# EAGLE design PIC18F14K50 PTH USB Dev Board (EAGLE 5.11)
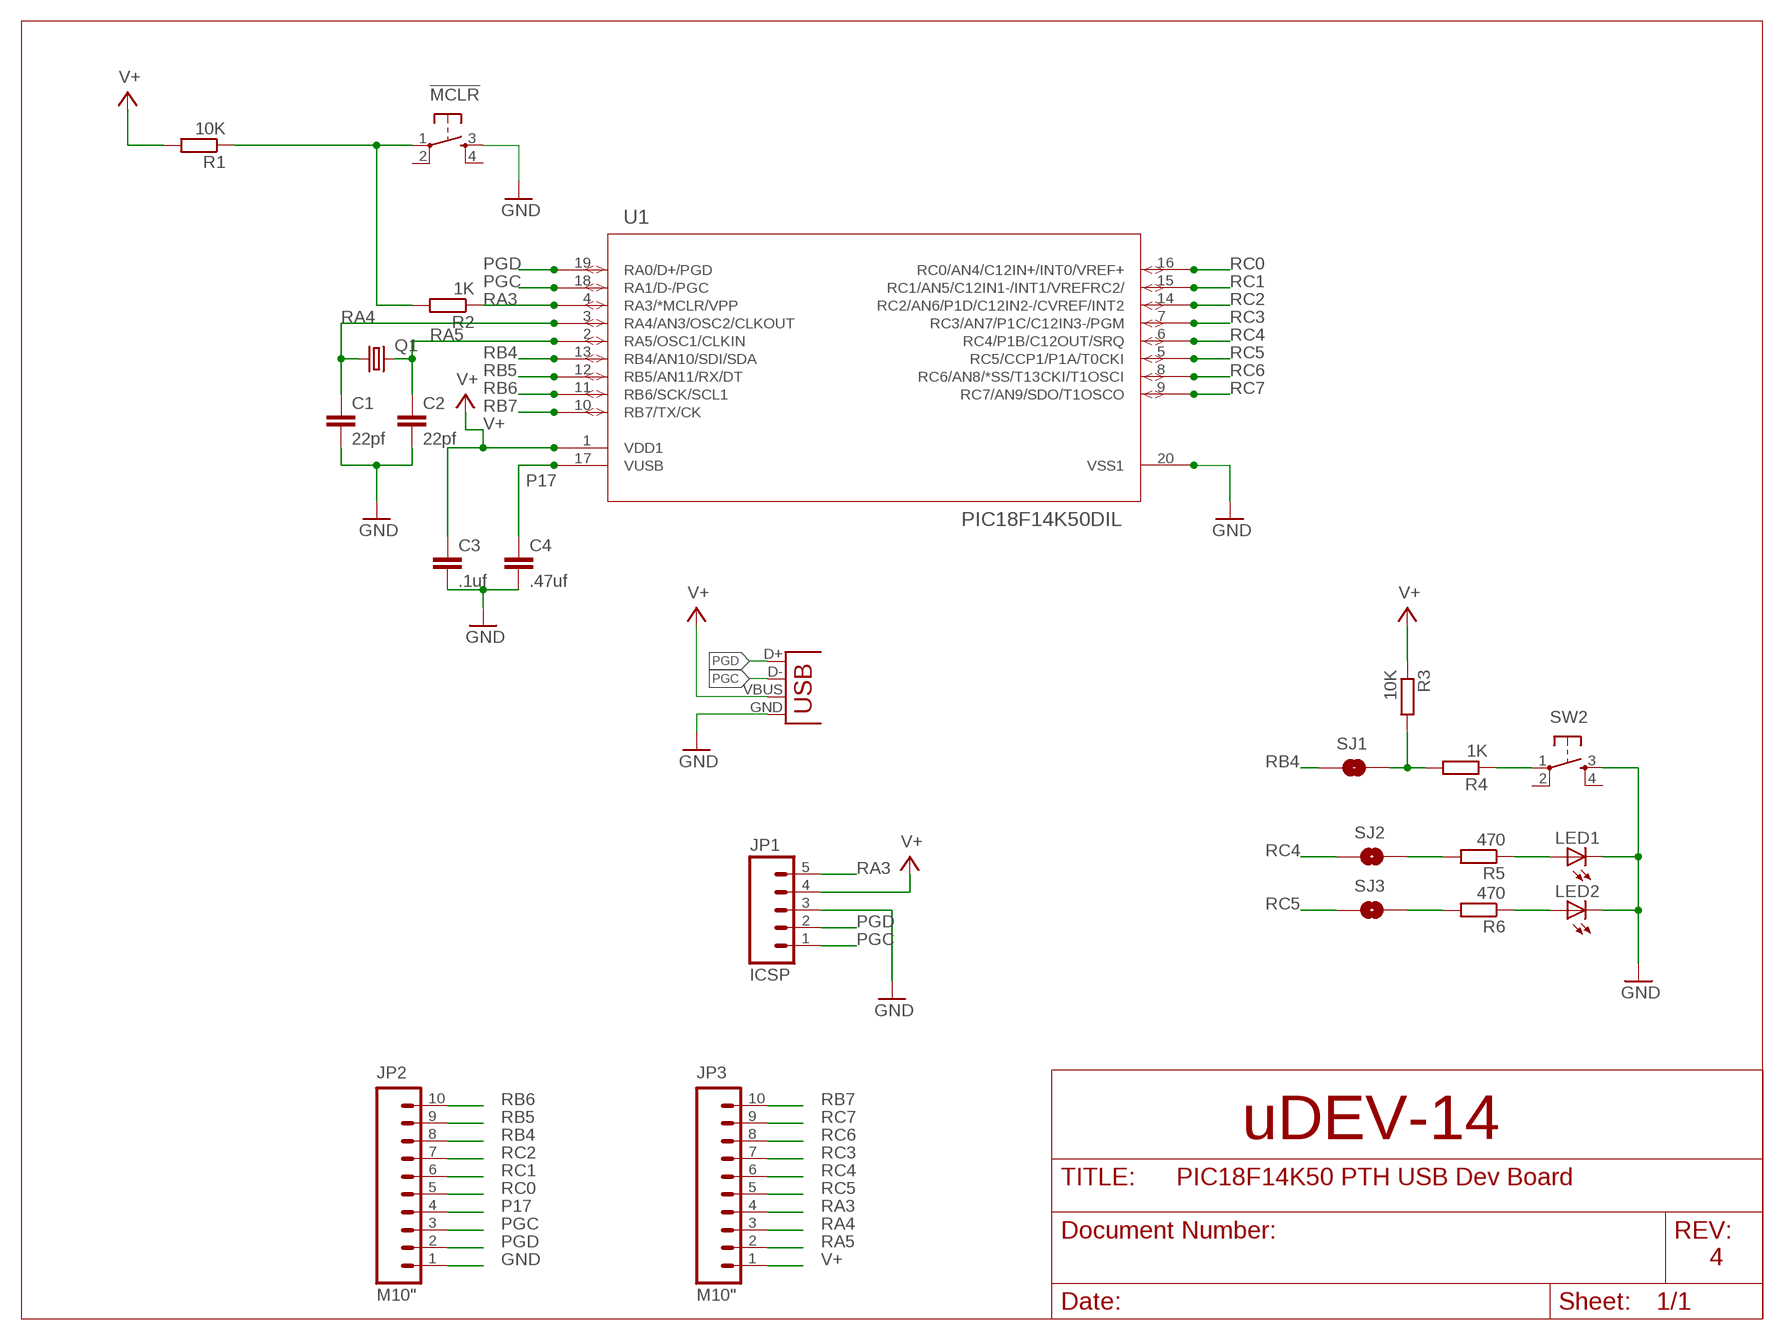
[diagram p0: schematic, sheet 1]

## Parts
!MCLR  TAC_SWITCHPTH  [TACTILE-PTH]
C1  22pf  C-EU025-025X050  [C025-025X050]
C2  22pf  C-EU025-025X050  [C025-025X050]
C3  .1uf  C-EU025-025X050  [C025-025X050]
C4  .47uf  C-EU025-025X050  [C025-025X050]
JP1  ICSP  M05PTH  [1X05]
JP2  M10"  [1X10]
JP3  M10"  [1X10]
LED1  LED3MM  [LED3MM]
LED2  LED3MM  [LED3MM]
Q1  CRYSTALHC49US  [HC49US]
R1  10K  R-EU_0207/2V  [0207/2V]
R2  1K  R-EU_0207/2V  [0207/2V]
R3  10K  R-EU_0207/2V  [0207/2V]
R4  1K  R-EU_0207/2V  [0207/2V]
R5  470  R-EU_0207/2V  [0207/2V]
R6  470  R-EU_0207/2V  [0207/2V]
SJ1  SOLDERJUMPERTRACE  [SJ_2S-TRACE]
SJ2  SOLDERJUMPERTRACE  [SJ_2S-TRACE]
SJ3  SOLDERJUMPERTRACE  [SJ_2S-TRACE]
SW2  TAC_SWITCHPTH  [TACTILE-PTH]
U1  PIC18F14K50DIL  [DIL20]
X1  USBPTH  [USB-B-PTH]

## Nets
GND: !MCLR.3 C1.2 C2.2 C3.2 C4.2 JP1.3 JP2.1 LED1.K(C) LED2.K(C) SW2.3 U1.20(VSS1) X1.GND
N$3: !MCLR.1 R1.1 R2.2
N$5: LED1.A R5.1
N$6: R5.2 SJ2.2
N$7: LED2.A R6.1
N$8: R6.2 SJ3.2
N$9: R4.1 SW2.1
N$10: R3.2 R4.2 SJ1.2
P17: C4.1 JP2.4 U1.17(VUSB)
PGC: JP1.1 JP2.3 U1.18(RA1/D-/PGC) X1.D-
PGD: JP1.2 JP2.2 U1.19(RA0/D+/PGD) X1.D+
RA3: JP1.5 JP3.4 R2.1 U1.4(RA3/*MCLR/VPP)
RA4: C1.1 JP3.3 Q1.1 U1.3(RA4/AN3/OSC2/CLKOUT)
RA5: C2.1 JP3.2 Q1.2 U1.2(RA5/OSC1/CLKIN)
RB4: JP2.8 SJ1.1 U1.13(RB4/AN10/SDI/SDA)
RB5: JP2.9 U1.12(RB5/AN11/RX/DT)
RB6: JP2.10 U1.11(RB6/SCK/SCL1)
RB7: JP3.10 U1.10(RB7/TX/CK)
RC0: JP2.5 U1.16(RC0/AN4/C12IN+/INT0/VREF+)
RC1: JP2.6 U1.15(RC1/AN5/C12IN1-/INT1/VREFRC2/)
RC2: JP2.7 U1.14(RC2/AN6/P1D/C12IN2-/CVREF/INT2)
RC3: JP3.7 U1.7(RC3/AN7/P1C/C12IN3-/PGM)
RC4: JP3.6 SJ2.1 U1.6(RC4/P1B/C12OUT/SRQ)
RC5: JP3.5 SJ3.1 U1.5(RC5/CCP1/P1A/T0CKI)
RC6: JP3.8 U1.8(RC6/AN8/*SS/T13CKI/T1OSCI)
RC7: JP3.9 U1.9(RC7/AN9/SDO/T1OSCO)
V+: C3.1 JP1.4 JP3.1 R1.2 R3.1 U1.1(VDD1) X1.VBUS
Unconnected: !MCLR.2 !MCLR.4 SW2.2 SW2.4

## Notes on the sheet
- uDEV-14
- 4

## Library data of the parts
!MCLR SW2 = SparkFun:TAC_SWITCH: Momentary Switch Button commonly used for reset or general input. Spark Fun Electronics SKU : COM-00097
C1-C4 = rcl:C-EU: CAPACITOR, European symbol
JP1 = SparkFun:M05: Header 5 Standard 5-pin 0.1" header. Use with straight break away headers (SKU : PRT-00116), right angle break away headers (PRT-00553), swiss pins (PRT-00743), machine pins (PRT-00117), and female headers (PRT-00115). Molex polarized connector foot print use with SKU : PRT-08230 with associated crimp pins and housings.
JP2 JP3 = SparkFun:M10: Header 10 Standard 10-pin 0.1" header. Use with straight break away headers (SKU : PRT-00116), right angle break away headers (PRT-00553), swiss pins (PRT-00743), machine pins (PRT-00117), and female headers (PRT-00115).
LED1 LED2 = led:LED: LED OSRAM: - CHIPLED LG R971, LG N971, LY N971, LG Q971, LY Q971, LO R971, LY R971 LH N974, LH R974 LS Q976, LO Q976, LY Q976 LO Q996 - Hyper CHIPLED LW Q18S LB Q993, LB Q99A, LB R99A - SideLED LS A670, LO A670, LY A670, LG A670, LP A670 LB A673, LV A673, LT A673, LW A673 LH A674 LY A675 LS A676, LA A676, LO A676, LY A676, LW A676 LS A679, LY A679, LG A679 - Hyper Micro SIDELED® LS Y876, LA Y876, LO Y876, LY Y876 LT Y87S - SmartLED LW L88C, LW L88S LB L89C, LB L89S, LG L890 LS L89K, LO L89K, LY L89K LS L896, LA L896, LO L896, LY L896 - TOPLED LS T670, LO T670, LY T670, LG T670, LP T670 LSG T670, LSP T670, LSY T670, LOP T670, LYG T670 LG T671, LOG T671, LSG T671 LB T673, LV T673, LT T673, LW T673 LH T674 LS T676, LA T676, LO T676, LY T676, LB T676, LH T676, LSB T676, LW T676 LB T67C, LV T67C, LT T67C, LS T67K, LO T67K, LY T67K, LW E67C LS E67B, LA E67B, LO E67B, LY E67B, LB E67C, LV E67C, LT E67C LW T67C LS T679, LY T679, LG T679 LS T770, LO T770, LY T770, LG T770, LP T770 LB T773, LV T773, LT T773, LW T773 LH T774 LS E675, LA E675, LY E675, LS T675 LS T776, LA T776, LO T776, LY T776, LB T776 LHGB T686 LT T68C, LB T68C - Hyper Mini TOPLED® LB M676 - Mini TOPLED Santana® LG M470 LS M47K, LO M47K, LY M47K Source: http://www.osram.convergy.de LUXEON: - LUMILED® LXK2-PW12-R00, LXK2-PW12-S00, LXK2-PW14-U00, LXK2-PW14-V00 LXK2-PM12-R00, LXK2-PM12-S00, LXK2-PM14-U00 LXK2-PE12-Q00, LXK2-PE12-R00, LXK2-PE12-S00, LXK2-PE14-T00, LXK2-PE14-U00 LXK2-PB12-K00, LXK2-PB12-L00, LXK2-PB12-M00, LXK2-PB14-N00, LXK2-PB14-P00, LXK2-PB14-Q00 LXK2-PR12-L00, LXK2-PR12-M00, LXK2-PR14-Q00, LXK2-PR14-R00 LXK2-PD12-Q00, LXK2-PD12-R00, LXK2-PD12-S00 LXK2-PH12-R00, LXK2-PH12-S00 LXK2-PL12-P00, LXK2-PL12-Q00, LXK2-PL12-R00 Source: www.luxeon.com KINGBRIGHT: KA-3528ASYC Source: www.kingbright.com
Q1 = SparkFun:CRYSTAL: Crystals Various standard crystals. Proven footprints. Spark Fun Electronics SKU : COM-00534
R1-R6 = rcl:R-EU_: RESISTOR, European symbol
SJ1-SJ3 = SparkFun:SOLDERJUMPER: Solder Jumper Standard SMD solder jumper. Used to automate production. Two varients : Normally Open and Normally Closed are the same, but have different paste layers. NC will have a large amount of paste and should jumper during reflow.
U1 = TAUTIC:PIC18F14K50
X1 = SparkFun:USB: USB Connectors USB-B-PTH is fully proven SKU : PRT-00139 USB-miniB is fully proven SKU : PRT-00587 USB-A-PCB is untested. USB-A-H is throughly reviewed, but untested. Spark Fun Electronics SKU : PRT-00437 USB-B-SMT is throughly reviewed, but untested. Needs silkscreen touching up. USB-A-S has not been used/tested USB-MB-H has not been used/tested

## Board
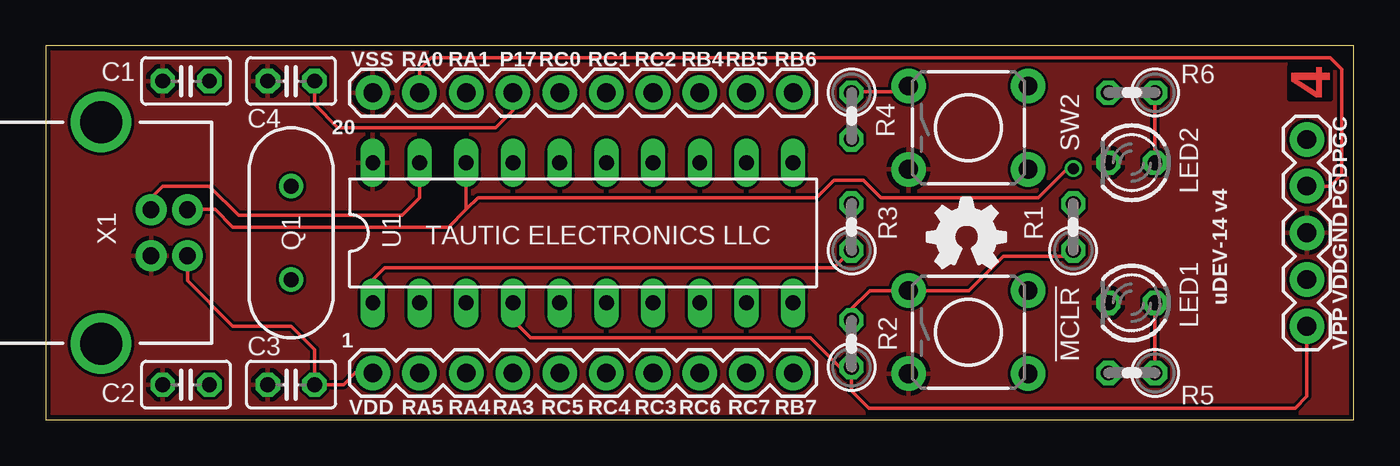
[diagram p1: board, top side]
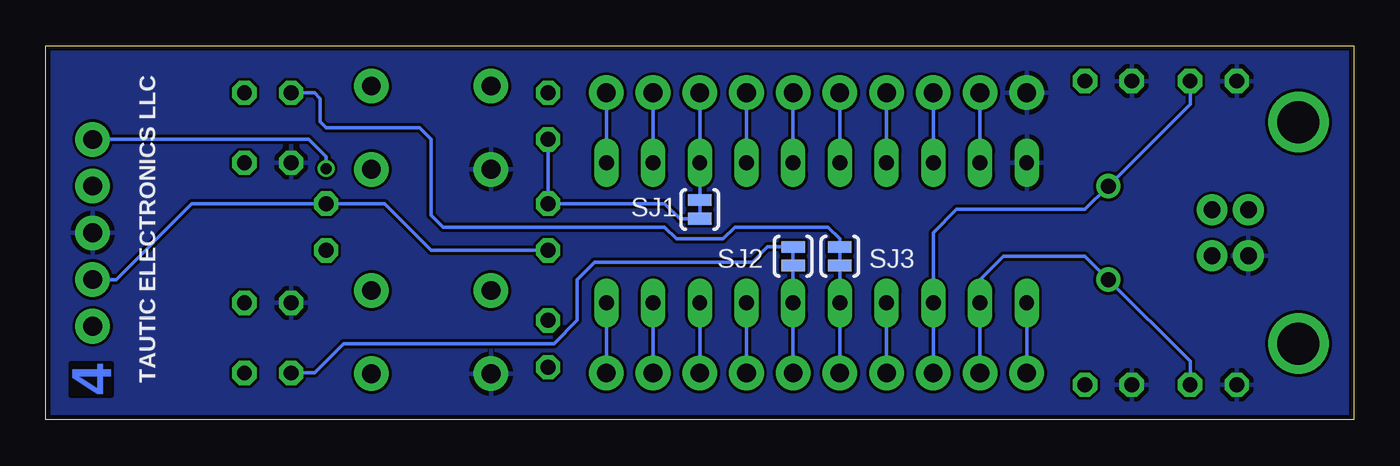
[diagram p2: board, bottom side, seen from below]

Size 71.12 x 20.32 mm. Coordinates in mm from the lower left corner, seen from the top.
Outline: 0,0 71.12,0 71.12,20.32 0,20.32 0,0
Copper layers (1*16): Top 0.035mm / dielectric 1.5mm / Bottom 0.035mm
Design rules "ITead_rule": minimum track width 6mil, minimum drill 12mil, track to track 6mil, track to pad 6mil, pad to pad 6mil, via to via 6mil, smd to smd 0mil, copper to edge 10mil, drill to drill 10mil, minimum pad ring 10mil, minimum via ring 6mil, stop-mask expansion 2mil, vias tented up to drill 100mil, thermal gap 10mil

### Footprints (pad centres in the part's own frame; a part is rotated, then mirrored left to right if it is on the bottom)
TACTILE-PTH = drill 1.016 pad 1.88 round: 1 -3.251,2.261; 2 3.251,2.261; 3 -3.251,-2.261; 4 3.251,-2.261
C025-025X050 = drill 0.813 octagon: 1 -1.27,0; 2 1.27,0
1X05 = drill 1.016 pad 1.88 round: 1 0,0; 2 2.54,0; 3 5.08,0; 4 7.62,0; 5 10.16,0
1X10 = drill 1.016 pad 1.88 round: 1 0,0; 2 2.54,0; 3 5.08,0; 4 7.62,0; 5 10.16,0; 6 12.7,0; 7 15.24,0; 8 17.78,0; 9 20.32,0; 10 22.86,0
LED3MM = drill 0.813 octagon: A -1.27,0; K 1.27,0
HC49US = drill 0.813 round: 1 -2.54,0; 2 2.54,0
0207/2V = drill 0.813 octagon: 1 -1.27,0; 2 1.27,0
SJ_2S-TRACE = smd 0.635 x 1.27: 1 -0.508,0; 2 0.508,0
DIL20 = drill 0.813 long: 1 -11.43,-3.81; 2 -8.89,-3.81; 3 -6.35,-3.81; 4 -3.81,-3.81; 5 -1.27,-3.81; 6 1.27,-3.81; 7 3.81,-3.81; 8 6.35,-3.81; 9 8.89,-3.81; 10 11.43,-3.81; 11 11.43,3.81; 12 8.89,3.81; 13 6.35,3.81; 14 3.81,3.81; 15 1.27,3.81; 16 -1.27,3.81; 17 -3.81,3.81; 18 -6.35,3.81; 19 -8.89,3.81; 20 -11.43,3.81
USB-B-PTH = drill 0.914 pad 1.676 round: D+ 0,1.25; D- 1.981,1.25; GND 0,-1.25; VBUS 1.981,-1.25 | drill 2.286 round: P$1 -2.718,-6.02; P$2 -2.718,6.02

### Placement (x,y rotation side)
!MCLR  50.16,4.76 0 top
C1  7.62,18.41 180 top
C2  7.62,1.91 180 top
C3  13.34,1.91 180 top
C4  13.34,18.41 180 top
JP1  68.58,15.24 270 top
JP2  17.78,17.78 0 top
JP3  17.78,2.54 0 top
LED1  59.05,6.35 180 top
LED2  59.05,13.97 180 top
Q1  13.34,10.16 270 top
R1  55.88,10.48 90 top
R2  43.81,4.13 90 top
R3  43.81,10.48 90 top
R4  43.81,16.51 270 top
R5  59.05,2.54 180 top
R6  59.05,17.78 180 top
SJ1  35.56,11.43 270 bottom
SJ2  30.48,8.89 90 bottom
SJ3  27.94,8.89 90 bottom
SW2  50.16,15.88 0 top
U1  29.21,10.16 0 top
U$1  [OSHW_FILLX150_NOTEXT]  47.94,8.26 0 top
X1  5.71,10.16 0 top

### Tracks (layer width: path | path; a pad name or v marks a point on that pad's centre or on a via)
GND
  pour Bottom: -1.27,21.59 77.47,21.59 76.2,-1.27 -1.27,-1.27
  pour Top: -1.27,21.59 78.74,21.59 78.74,-1.27 -1.27,-1.27
N$3
  Top 0.203: R2.2 43.81,6.03 44.81,7.02 !MCLR.1 50.2,7.02 52.07,8.89 55.56,8.89 R1.1
N$5
  Top 0.203: R5.1 LED1.A
N$6
  Bottom 0.203: SJ2.2 31.88,9.4 32.7,8.57 41.27,8.57 42.23,7.62 42.23,5.4 43.5,4.13 54.93,4.13 56.52,2.54 R5.2
N$7
  Top 0.203: LED2.A R6.1
N$8
  Bottom 0.203: SJ3.2 27.94,9.84 28.57,10.48 33.66,10.48 34.29,9.84 36.83,9.84 37.47,10.48 49.53,10.48 50.16,11.11 50.16,15.24 50.8,15.88 55.88,15.88 56.2,16.19 56.2,17.46 56.52,17.78 R6.2
N$9
  Top 0.203: R4.1 43.85,17.82 46.6,17.82 SW2.1
N$10
  Bottom 0.203: SJ1.2 36.64,10.92 37.47,11.75 R3.2 R4.2
P17
  Top 0.203: JP2.4 25.4,16.83 24.45,15.88 15.88,15.88 14.61,17.14 C4.1
  Bottom 0.203: JP2.4 U1.17
PGC  (via drill 0.6)
  Top 0.203: 22.86,11.43 21.91,10.48 10.16,10.48 9.21,11.43 7.72,11.43 X1.D- | 22.86,11.43 U1.18 | 22.86,11.43 23.5,12.06 41.91,12.06 42.86,13.02 44.45,13.02 45.4,12.06 53.98,12.06 55.56,13.65 v55.88,13.65
  Bottom 0.203: U1.18 JP2.3 | v55.88,13.65 55.88,14.29 56.83,15.24 JP1.1
PGD
  Top 0.203: U1.19 20.32,12.06 19.37,11.11 10.48,11.11 8.89,12.7 6.35,12.7 5.71,12.06 X1.D+ | JP2.2 20.32,19.05 20.95,19.68 69.85,19.68 70.48,19.05 70.48,13.34 69.85,12.7 JP1.2
  Bottom 0.203: U1.19 JP2.2
RA3
  Top 0.203: U1.4 25.4,5.4 26.35,4.45 41.59,4.45 43.18,2.86 R2.1 43.81,1.59 44.77,0.64 67.94,0.64 68.58,1.27 JP1.5
  Bottom 0.203: JP3.4 U1.4
RA4
  Bottom 0.203: JP3.3 U1.3 22.86,10.16 21.59,11.43 14.61,11.43 Q1.1 8.89,17.14 C1.1
RA5
  Bottom 0.203: JP3.2 U1.2 20.32,7.62 19.05,8.89 14.61,8.89 Q1.2 8.89,3.17 C2.1
RB4
  Bottom 0.203: JP2.8 U1.13 SJ1.1
RB5
  Bottom 0.203: U1.12 JP2.9
RB6
  Bottom 0.203: U1.11 JP2.10
RB7
  Bottom 0.203: JP3.10 U1.10
RC0
  Bottom 0.203: U1.16 JP2.5
RC1
  Bottom 0.203: U1.15 JP2.6
RC2
  Bottom 0.203: U1.14 JP2.7
RC3
  Bottom 0.203: JP3.7 U1.7
RC4
  Bottom 0.203: JP3.6 U1.6 SJ2.1
RC5
  Bottom 0.203: JP3.5 U1.5 SJ3.1
RC6
  Bottom 0.203: JP3.8 U1.8
RC7
  Bottom 0.203: JP3.9 U1.9
V+
  Top 0.203: U1.1 17.78,7.62 18.41,8.26 42.86,8.26 R3.1 | X1.VBUS 7.7,7.54 10.16,5.08 13.34,5.08 14.61,3.81 C3.1 16.19,1.91 16.83,2.54 JP3.1
  Bottom 0.203: JP3.1 U1.1 | R3.1 50.16,9.21 52.7,11.75 R1.2 63.18,11.75 67.31,7.62 JP1.4

### Text on the board
Top: 4
Bottom: 4
tPlace: VSS | RA0 | RA1 | P17 | RC0 | RC1 | RC2 | RB4 | RB5 | RB6 | PGC | 20 | PGD | GND | TAUTIC ELECTRONICS LLC | VDD | uDEV-14 v4 | VPP | 1 | VDD | RA5 | RA4 | RA3 | RC5 | RC4 | RC3 | RC6 | RC7 | RB7
bNames: TAUTIC ELECTRONICS LLC
tStop: TAUTIC.COM
bStop: TAUTIC.COM